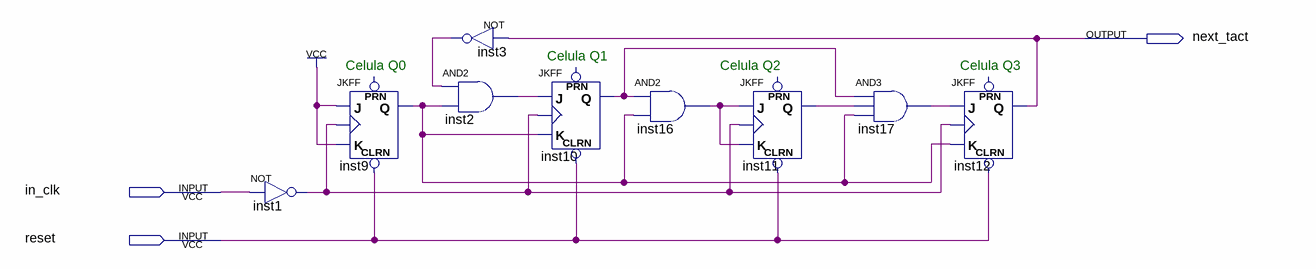
[diagram p0: schematic sheet]
// Quartus schematic divizor_10_test.bdf as structural Verilog: 9 symbols, 3 pins
module divizor_10_test (
  input  in_clk,
  input  reset,
  output next_tact
);

  wire inst1_out, inst2_out, inst3_out, inst9_q, inst10_q, inst11_q, inst16_out, inst17_out;

  not inst1 (inst1_out, in_clk);
  JKFF inst9 (.CLRN(reset), .K(1'b1), .J(1'b1), .CLK(inst1_out), .Q(inst9_q));  // open: PRN
  not inst3 (inst3_out, next_tact);
  and inst2 (inst2_out, inst3_out, inst9_q);
  JKFF inst10 (.CLRN(reset), .K(inst9_q), .J(inst2_out), .CLK(inst1_out), .Q(inst10_q));  // open: PRN
  and inst16 (inst16_out, inst10_q, inst9_q);
  JKFF inst11 (.CLRN(reset), .K(inst16_out), .J(inst16_out), .CLK(inst1_out), .Q(inst11_q));  // open: PRN
  and inst17 (inst17_out, inst10_q, inst11_q, inst9_q);
  JKFF inst12 (.CLRN(reset), .K(inst9_q), .J(inst17_out), .CLK(inst1_out), .Q(next_tact));  // open: PRN

  // Notes on the sheet:
  //   Celula Q1
  //   Celula Q0
  //   Celula Q2
  //   Celula Q3
endmodule
